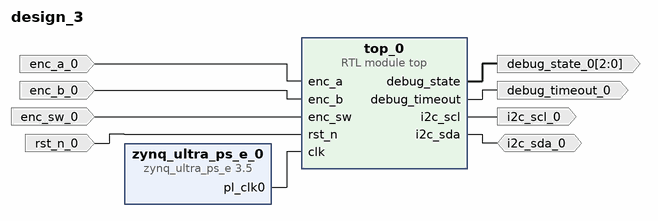
[diagram p0: block diagram of the top level]
# Vivado block design design_3, xczu1cg-sbva484-1-e, Vivado 2025.1
create_bd_design design_3

create_bd_port -dir IO i2c_sda_0
create_bd_port -dir O i2c_scl_0
create_bd_port -dir O -from 2 -to 0 debug_state_0
create_bd_port -dir O debug_timeout_0
create_bd_port -dir I -type rst rst_n_0
create_bd_port -dir I enc_a_0
create_bd_port -dir I enc_b_0
create_bd_port -dir I enc_sw_0

create_bd_cell -type ip -vlnv xilinx.com:ip:zynq_ultra_ps_e:3.5 zynq_ultra_ps_e_0
set_property -dict {CONFIG.PSU__DDR_HIGH_ADDRESS_GUI_ENABLE 0 CONFIG.PSU__USE__M_AXI_GP2 0} [get_bd_cells zynq_ultra_ps_e_0]
# 2 more settings of zynq_ultra_ps_e_0 are not shown: defaults, MIO pin electricals, DDR timing, and values the tool derives
create_bd_cell -type module -reference top top_0

# ---- connections ----

connect_bd_net [get_bd_ports i2c_sda_0] [get_bd_pins top_0/i2c_sda]
connect_bd_net -net enc_a_0_1 [get_bd_ports enc_a_0] [get_bd_pins top_0/enc_a]
connect_bd_net -net enc_b_0_1 [get_bd_ports enc_b_0] [get_bd_pins top_0/enc_b]
connect_bd_net -net enc_sw_0_1 [get_bd_ports enc_sw_0] [get_bd_pins top_0/enc_sw]
connect_bd_net -net rst_n_0_1 [get_bd_ports rst_n_0] [get_bd_pins top_0/rst_n]
connect_bd_net [get_bd_pins top_0/debug_state] [get_bd_ports debug_state_0]
connect_bd_net [get_bd_pins top_0/debug_timeout] [get_bd_ports debug_timeout_0]
connect_bd_net [get_bd_pins top_0/i2c_scl] [get_bd_ports i2c_scl_0]
connect_bd_net [get_bd_pins zynq_ultra_ps_e_0/pl_clk0] [get_bd_pins top_0/clk]

validate_bd_design
save_bd_design
